# EAGLE design cathode_pcb (EAGLE 6.6.0)
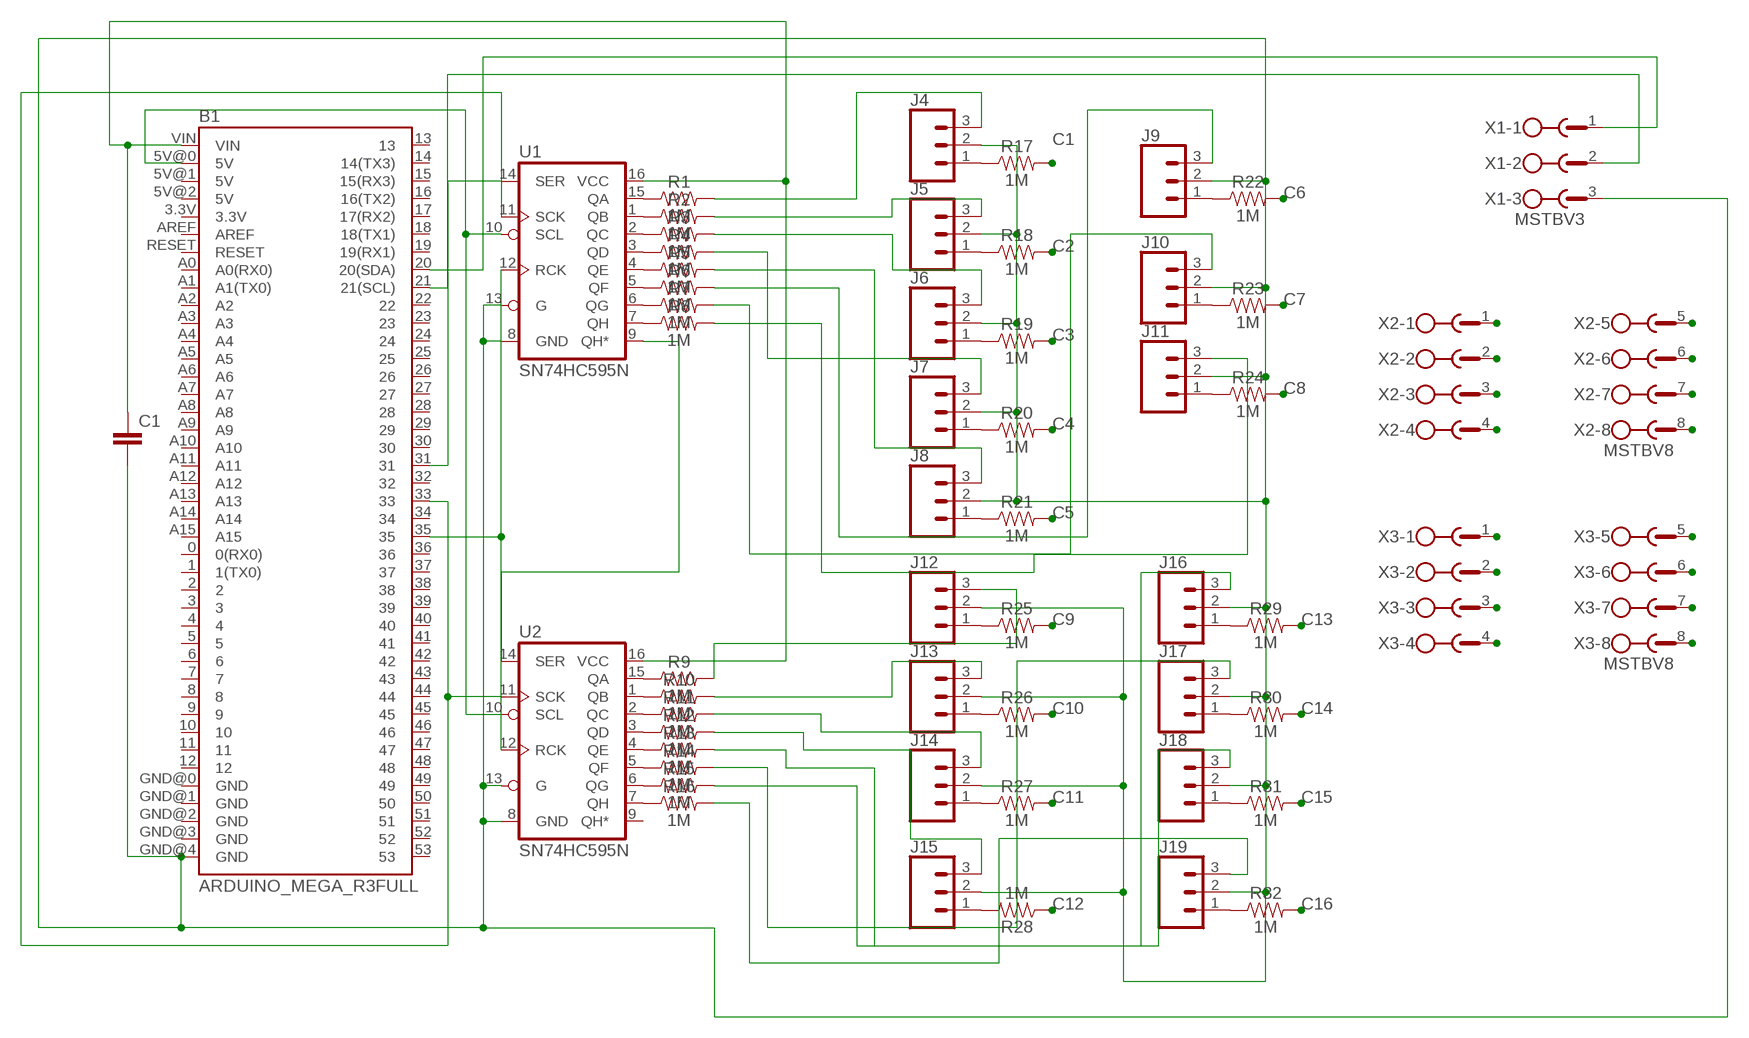
[diagram p0: schematic, sheet 1]

## Parts
B1  ARDUINO_MEGA_R3FULL  [ARDUINO_MEGA]
C1  C2.5/2  [C2.5-2]
J4  CONN_03  [1X03]
J5  CONN_03  [1X03]
J6  CONN_03  [1X03]
J7  CONN_03  [1X03]
J8  CONN_03  [1X03]
J9  CONN_03  [1X03]
J10  CONN_03  [1X03]
J11  CONN_03  [1X03]
J12  CONN_03  [1X03]
J13  CONN_03  [1X03]
J14  CONN_03  [1X03]
J15  CONN_03  [1X03]
J16  CONN_03  [1X03]
J17  CONN_03  [1X03]
J18  CONN_03  [1X03]
J19  CONN_03  [1X03]
R1  1M  1MOHM-HORIZ-1/4W-5%  [AXIAL-0.3]
R2  1M  1MOHM-HORIZ-1/4W-5%  [AXIAL-0.3]
R3  1M  1MOHM-HORIZ-1/4W-5%  [AXIAL-0.3]
R4  1M  1MOHM-HORIZ-1/4W-5%  [AXIAL-0.3]
R5  1M  1MOHM-HORIZ-1/4W-5%  [AXIAL-0.3]
R6  1M  1MOHM-HORIZ-1/4W-5%  [AXIAL-0.3]
R7  1M  1MOHM-HORIZ-1/4W-5%  [AXIAL-0.3]
R8  1M  1MOHM-HORIZ-1/4W-5%  [AXIAL-0.3]
R9  1M  1MOHM-HORIZ-1/4W-5%  [AXIAL-0.3]
R10  1M  1MOHM-HORIZ-1/4W-5%  [AXIAL-0.3]
R11  1M  1MOHM-HORIZ-1/4W-5%  [AXIAL-0.3]
R12  1M  1MOHM-HORIZ-1/4W-5%  [AXIAL-0.3]
R13  1M  1MOHM-HORIZ-1/4W-5%  [AXIAL-0.3]
R14  1M  1MOHM-HORIZ-1/4W-5%  [AXIAL-0.3]
R15  1M  1MOHM-HORIZ-1/4W-5%  [AXIAL-0.3]
R16  1M  1MOHM-HORIZ-1/4W-5%  [AXIAL-0.3]
R17  1M  1MOHM-HORIZ-1/4W-5%  [AXIAL-0.3]
R18  1M  1MOHM-HORIZ-1/4W-5%  [AXIAL-0.3]
R19  1M  1MOHM-HORIZ-1/4W-5%  [AXIAL-0.3]
R20  1M  1MOHM-HORIZ-1/4W-5%  [AXIAL-0.3]
R21  1M  1MOHM-HORIZ-1/4W-5%  [AXIAL-0.3]
R22  1M  1MOHM-HORIZ-1/4W-5%  [AXIAL-0.3]
R23  1M  1MOHM-HORIZ-1/4W-5%  [AXIAL-0.3]
R24  1M  1MOHM-HORIZ-1/4W-5%  [AXIAL-0.3]
R25  1M  1MOHM-HORIZ-1/4W-5%  [AXIAL-0.3]
R26  1M  1MOHM-HORIZ-1/4W-5%  [AXIAL-0.3]
R27  1M  1MOHM-HORIZ-1/4W-5%  [AXIAL-0.3]
R28  1M  1MOHM-HORIZ-1/4W-5%  [AXIAL-0.3]
R29  1M  1MOHM-HORIZ-1/4W-5%  [AXIAL-0.3]
R30  1M  1MOHM-HORIZ-1/4W-5%  [AXIAL-0.3]
R31  1M  1MOHM-HORIZ-1/4W-5%  [AXIAL-0.3]
R32  1M  1MOHM-HORIZ-1/4W-5%  [AXIAL-0.3]
U1  SN74HC595N  74HC595N  [DIP16]
U2  SN74HC595N  74HC595N  [DIP16]
X1  MSTBV3  [MSTBV3]
X2  MSTBV8  [MSTBV8]
X3  MSTBV8  [MSTBV8]

## Nets
C1: R17.P$2 X2.1
C2: R18.P$2 X2.2
C3: R19.P$2 X2.3
C4: R20.P$2 X2.4
C5: R21.P$2 X2.5
C6: R22.P$2 X2.6
C7: R23.P$2 X2.7
C8: R24.P$2 X2.8
C9: R25.P$2 X3.1
C10: R26.P$2 X3.2
C11: R27.P$2 X3.3
C12: R28.P$1 X3.4
C13: R29.P$2 X3.5
C14: R30.P$2 X3.6
C15: R31.P$2 X3.7
C16: R32.P$2 X3.8
N$1: J4.3 R1.P$2
N$2: J5.3 R2.P$2
N$3: R1.P$1 U1.15(QA)
N$4: R2.P$1 U1.1(QB)
N$5: R3.P$1 U1.2(QC)
N$6: R4.P$1 U1.3(QD)
N$7: R5.P$1 U1.4(QE)
N$8: R6.P$1 U1.5(QF)
N$9: R7.P$1 U1.6(QG)
N$10: R8.P$1 U1.7(QH)
N$11: R9.P$1 U2.15(QA)
N$12: R10.P$1 U2.1(QB)
N$13: R11.P$1 U2.2(QC)
N$14: R12.P$1 U2.3(QD)
N$15: R13.P$1 U2.4(QE)
N$16: R14.P$1 U2.5(QF)
N$17: R15.P$1 U2.6(QG)
N$18: R16.P$1 U2.7(QH)
N$19: J6.3 R3.P$2
N$20: J7.3 R4.P$2
N$21: J8.3 R5.P$2
N$22: J9.3 R6.P$2
N$23: J10.3 R7.P$2
N$24: J11.3 R8.P$2
N$25: J12.3 R9.P$2
N$26: J13.3 R10.P$2
N$27: J14.3 R11.P$2
N$28: J15.3 R12.P$2
N$29: J16.3 R13.P$2
N$30: U1.9(QH*) U2.14(SER)
N$31: J17.3 R14.P$2
N$32: J18.3 R15.P$2
N$33: J19.3 R16.P$2
N$34: B1.5V@0(5V) U1.10(SCL) U2.10(SCL)
N$35: B1.31 U1.14(SER)
N$36: B1.GND@4(GND) C1.2 J4.2 J5.2 J6.2 J7.2 J8.2 J9.2 J10.2 J11.2 J12.2 J13.2 J14.2 J15.2 J16.2 J17.2 J18.2 J19.2 U1.8(GND) U1.13(G) U2.8(GND) U2.13(G) X1.3
N$37: B1.35 U1.12(RCK) U2.12(RCK)
N$38: B1.33 U1.11(SCK) U2.11(SCK)
N$39: J19.1 R32.P$1
N$40: J18.1 R31.P$1
N$41: J17.1 R30.P$1
N$42: J16.1 R29.P$1
N$43: J15.1 R28.P$2
N$44: J14.1 R27.P$1
N$45: J13.1 R26.P$1
N$46: J12.1 R25.P$1
N$47: J11.1 R24.P$1
N$48: J10.1 R23.P$1
N$49: J9.1 R22.P$1
N$50: J4.1 R17.P$1
N$51: J5.1 R18.P$1
N$52: J6.1 R19.P$1
N$53: J7.1 R20.P$1
N$54: J8.1 R21.P$1
N$55: B1.20(20(SDA)) X1.1
N$56: B1.21(21(SCL)) X1.2
N$57: B1.VIN C1.1 U1.16(VCC) U2.16(VCC)
Unconnected: B1.0(0(RX0)) B1.1(1(TX0)) B1.2 B1.3 B1.3.3V B1.4 B1.5 B1.5V@1(5V) B1.5V@2(5V) B1.6 B1.7 B1.8 B1.9 B1.10 B1.11 B1.12 B1.13 B1.14(14(TX3)) B1.15(15(RX3)) B1.16(16(TX2)) B1.17(17(RX2)) B1.18(18(TX1)) B1.19(19(RX1)) B1.22 B1.23 B1.24 B1.25 B1.26 B1.27 B1.28 B1.29 B1.30 B1.32 B1.34 B1.36 B1.37 B1.38 B1.39 B1.40 B1.41 B1.42 B1.43 B1.44 B1.45 B1.46 B1.47 B1.48 B1.49 B1.50 B1.51 B1.52 B1.53 B1.A0(A0(RX0)) B1.A1(A1(TX0)) B1.A2 B1.A3 B1.A4 B1.A5 B1.A6 B1.A7 B1.A8 B1.A9 B1.A10 B1.A11 B1.A12 B1.A13 B1.A14 B1.A15 B1.AREF B1.GND@0(GND) B1.GND@1(GND) B1.GND@2(GND) B1.GND@3(GND) B1.RESET U2.9(QH*)

## Library data of the parts
B1 = SparkFun-Boards:ARDUINO_MEGA_R3: Arduino Mega R3 ATmega2560 R3 compatible footprint. SparkFun Products: Arduino Mega 2560 R3 <https://www.sparkfun.com/products/11061>
C1 = capacitor-wima:C: CAPACITOR naming: grid - package width
J4-J19 = SparkFun-Connectors:CONN_03: Multi connection point. Often used as Generic Header-pin footprint for 0.1 inch spaced/style header connections On any of the 0.1 inch spaced packages, you can populate with these: Break Away Headers - Straight <https://www.sparkfun.com/products/116> (PRT-00116) Break Away Male Headers - Right Angle <https://www.sparkfun.com/products/553> (PRT-00553) Female Headers <https://www.sparkfun.com/products/115> (PRT-00115) Break Away Headers - Machine Pin <https://www.sparkfun.com/products/117> (PRT-00117) Break Away Female Headers - Swiss Machine Pin <https://www.sparkfun.com/products/743> (PRT-00743) Stackable Header - 3 Pin (Female, 0.1") <https://www.sparkfun.com/products/13875> (PRT-13875) For SCREWTERMINALS and SPRING TERMINALS visit here: Screw Terimnals on SparkFun.com <https://www.sparkfun.com/search/results?term=Screw+Terminals> (5mm/3.5mm/2.54mm spacing) This device is also useful as a general connection point to wire up your design to another part of your project. Our various solder wires solder well into these plated through hole pads. Hook-Up Wire - Assortment (Stranded, 22 AWG) <https://www.sparkfun.com/products/11375> (PRT-11375) Hook-Up Wire - Assortment (Solid Core, 22 AWG) <https://www.sparkfun.com/products/11367> (PRT-11367) View the entire wire category on our website here <https://www.sparkfun.com/categories/141> Special notes: Molex polarized connector foot print use with SKU : PRT-08232 with associated crimp pins and housings.
R1-R32 = SparkFun-Resistors:1MOHM: 1MΩ resistor A resistor is a passive two-terminal electrical component that implements electrical resistance as a circuit element. Resistors act to reduce current flow, and, at the same time, act to lower voltage levels within circuits. - Wikipedia; PROD_ID: RES-09329
U1 U2 = SparkFun-IC-Logic:74*595: 8-Bit Shift Register (Serial to Parallel) Datasheet <http://cdn.sparkfun.com/datasheets/BreakoutBoards/MM74HC595.pdf> SparkFun Products SparkFun Shift Register Breakout - 74HC595 <https://www.sparkfun.com/products/10680> (BOB-10680); PROD_ID: IC-13123
X1 = con-phoenix-508:MSTBV3: PHOENIX; MPN: MSTBV 2,5/3-GF-5.08; OC_FARNELL: 1792793; OC_NEWARK: 69R9846
X2 X3 = con-phoenix-508:MSTBV8: PHOENIX; MPN: MSTBV 2,5/8-GF-5.08; OC_FARNELL: 1792797; OC_NEWARK: 69R9850

## Board
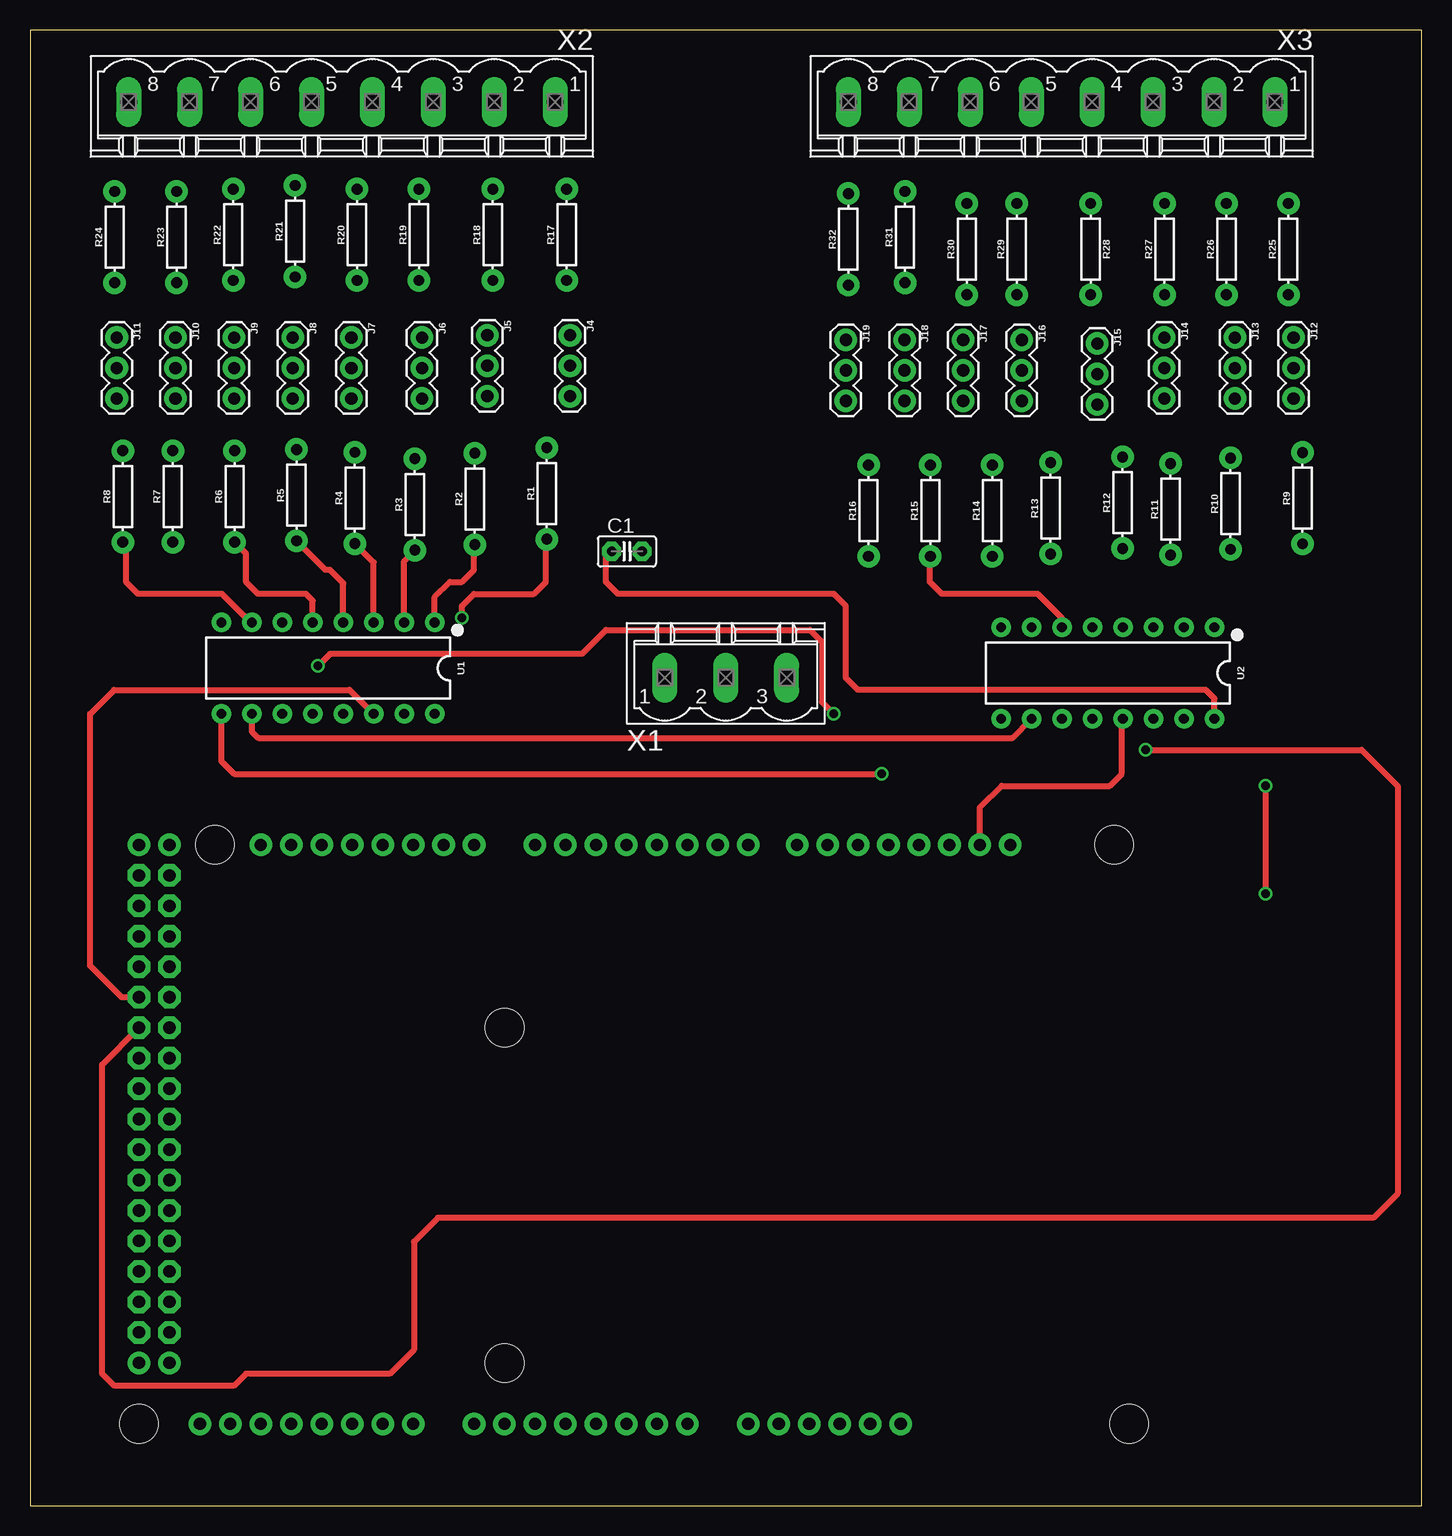
[diagram p1: board, top side]
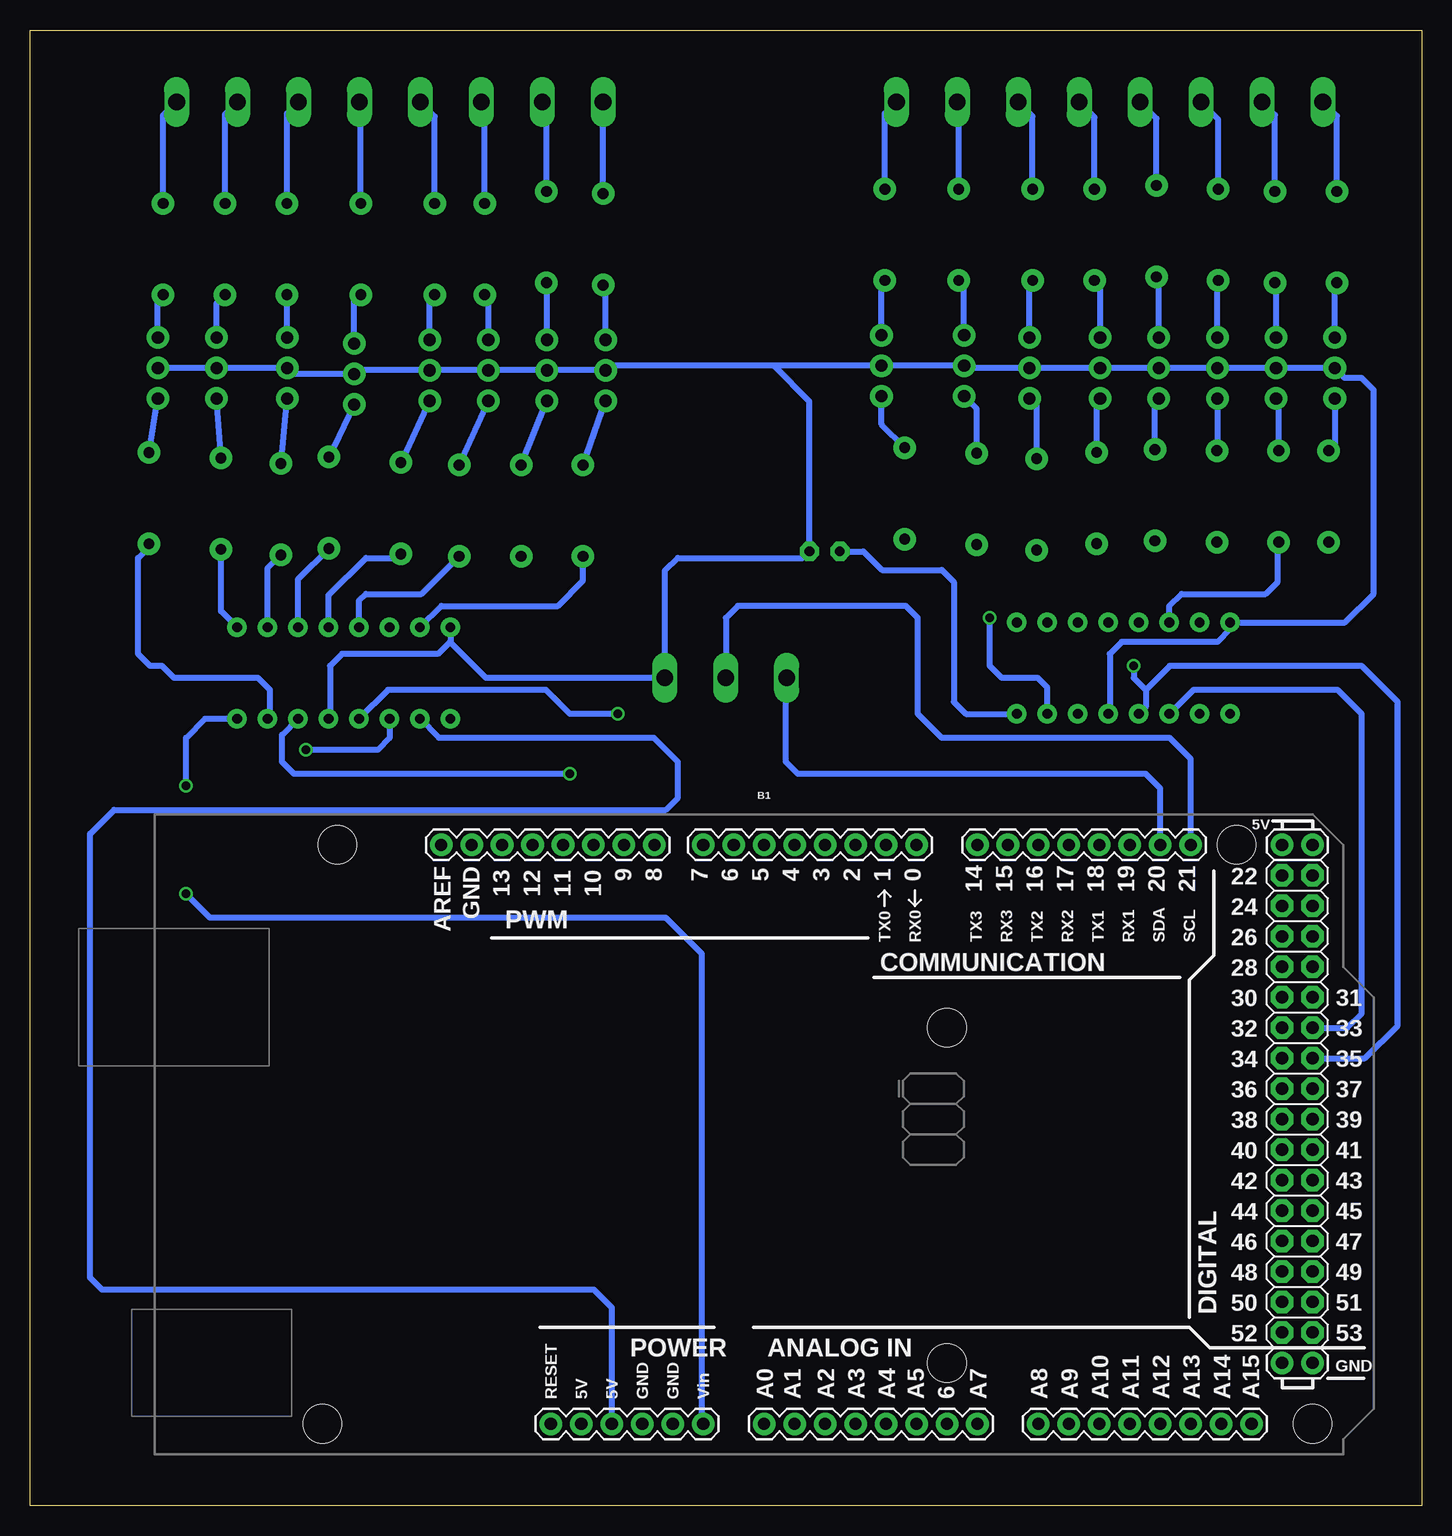
[diagram p2: board, bottom side, seen from below]

Size 116 x 123 mm. Coordinates in mm from the lower left corner, seen from the top.
Outline: 0,0 116,0 116,123 0,123 0,0
Copper layers (1*16): Top 0.035mm / dielectric 1.5mm / Bottom 0.035mm
Design rules "default": minimum track width 10mil, minimum drill 24mil, track to track 8mil, track to pad 8mil, pad to pad 8mil, via to via 8mil, smd to smd 8mil, copper to edge 40mil, drill to drill 8mil, minimum pad ring 10mil, minimum via ring 8mil, stop-mask expansion 4mil, vias tented up to drill 0mil, thermal gap 10mil

### Footprints (pad centres in the part's own frame; a part is rotated, then mirrored left to right if it is on the bottom)
ARDUINO_MEGA = drill 1.016 pad 1.88: 0 13.97,24.13; 1 11.43,24.13; 2 8.89,24.13; 3 6.35,24.13; 3.3V -13.97,-24.13; 4 3.81,24.13; 5 1.27,24.13; 5V@0 -11.43,-24.13; 5V@1 44.45,24.13; 5V@2 46.99,24.13; 6 -1.27,24.13; 7 -3.81,24.13; 8 -7.874,24.13; 9 -10.414,24.13; 10 -12.954,24.13; 11 -15.494,24.13; 12 -18.034,24.13; 13 -20.574,24.13; 14 19.05,24.13; 15 21.59,24.13; 16 24.13,24.13; 17 26.67,24.13; 18 29.21,24.13; 19 31.75,24.13; 20 34.29,24.13; 21 36.83,24.13; A0 1.27,-24.13; A1 3.81,-24.13; A2 6.35,-24.13; A3 8.89,-24.13; A4 11.43,-24.13; A5 13.97,-24.13; A6 16.51,-24.13; A7 19.05,-24.13; A8 24.13,-24.13; A9 26.67,-24.13; A10 29.21,-24.13; A11 31.75,-24.13; A12 34.29,-24.13; A13 36.83,-24.13; A14 39.37,-24.13; A15 41.91,-24.13; AREF -25.654,24.13; GND@0 -8.89,-24.13; GND@1 -6.35,-24.13; GND@2 44.45,-19.05; GND@3 46.99,-19.05; GND@4 -23.114,24.13; RESET -16.51,-24.13; VIN -3.81,-24.13 | drill 1.016 pad 1.88 octagon: 22 44.45,21.59; 23 46.99,21.59; 24 44.45,19.05; 25 46.99,19.05; 26 44.45,16.51; 27 46.99,16.51; 28 44.45,13.97; 29 46.99,13.97; 30 44.45,11.43; 31 46.99,11.43; 32 44.45,8.89; 33 46.99,8.89; 34 44.45,6.35; 35 46.99,6.35; 36 44.45,3.81; 37 46.99,3.81; 38 44.45,1.27; 39 46.99,1.27; 40 44.45,-1.27; 41 46.99,-1.27; 42 44.45,-3.81; 43 46.99,-3.81; 44 44.45,-6.35; 45 46.99,-6.35; 46 44.45,-8.89; 47 46.99,-8.89; 48 44.45,-11.43; 49 46.99,-11.43; 50 44.45,-13.97; 51 46.99,-13.97; 52 44.45,-16.51; 53 46.99,-16.51 | hole 3.2: -34.29,24.13; -35.56,-24.13; 16.51,8.89; 16.51,-19.05; 40.64,24.13; 46.99,-24.13
C2.5-2 = drill 0.813 pad 1.6 octagon: 1 -1.27,0; 2 1.27,0
1X03 = drill 1.016 pad 1.88: 1 0,0; 2 2.54,0; 3 5.08,0
AXIAL-0.3 = drill 0.9 pad 1.88: P$1 -3.81,0; P$2 3.81,0
DIP16 = drill 0.813 pad 1.626: 1 -8.89,-3.81; 2 -6.35,-3.81; 3 -3.81,-3.81; 4 -1.27,-3.81; 5 1.27,-3.81; 6 3.81,-3.81; 7 6.35,-3.81; 8 8.89,-3.81; 9 8.89,3.81; 10 6.35,3.81; 11 3.81,3.81; 12 1.27,3.81; 13 -1.27,3.81; 14 -3.81,3.81; 15 -6.35,3.81; 16 -8.89,3.81
MSTBV3 = drill 1.397 long: 1 -5.08,0; 2 0,0; 3 5.08,0
MSTBV8 = drill 1.397 long: 1 -17.78,0; 2 -12.7,0; 3 -7.62,0; 4 -2.54,0; 5 2.54,0; 6 7.62,0; 7 12.7,0; 8 17.78,0

### Placement (x,y rotation side)
B1  56.07,30.94 0 bottom
C1  49.76,79.54 0 top
J4  45.02,97.55 270 top
J5  38.13,97.55 270 top
J6  32.68,97.36 270 top
J7  26.79,97.36 270 top
J8  21.9,97.36 270 top
J9  17.01,97.36 270 top
J10  12.12,97.36 270 top
J11  7.23,97.36 270 top
J12  105.34,97.36 270 top
J13  100.45,97.36 270 top
J14  94.56,97.36 270 top
J15  88.97,96.86 270 top
J16  82.68,97.17 270 top
J17  77.79,97.17 270 top
J18  72.9,97.17 270 top
J19  68.01,97.17 270 top
R1  43.08,84.37 90 top
R2  37.08,83.91 90 top
R3  32.08,83.45 90 top
R4  27.08,83.99 90 top
R5  22.22,84.22 90 top
R6  17.06,84.12 90 top
R7  11.9,84.12 90 top
R8  7.74,84.12 90 top
R9  106.08,83.97 90 top
R10  100.08,83.51 90 top
R11  95.08,83.05 90 top
R12  91.08,83.59 90 top
R13  85.08,83.13 90 top
R14  80.22,82.93 90 top
R15  75.06,82.93 90 top
R16  69.9,82.93 90 top
R17  44.74,105.93 90 top
R18  38.58,105.93 90 top
R19  32.42,105.93 90 top
R20  27.26,105.93 90 top
R21  22.1,106.23 90 top
R22  16.94,105.93 90 top
R23  12.22,105.74 90 top
R24  7.06,105.74 90 top
R25  104.9,104.74 90 top
R26  99.74,104.74 90 top
R27  94.58,104.74 90 top
R28  88.42,104.74 270 top
R29  82.26,104.74 90 top
R30  78.1,104.74 90 top
R31  72.94,105.74 90 top
R32  68.22,105.55 90 top
U1  24.84,69.8 180 top
U2  89.84,69.4 180 top
X1  58,69 0 top
X2  26,117 180 top
X3  86,117 180 top

### Tracks (layer width: path | path; a pad name or v marks a point on that pad's centre or on a via)
C1
  Bottom 0.5: R17.P$2 44.74,116.04 X2.1
C2
  Bottom 0.5: R18.P$2 38.58,116.88 X2.2
C3
  Bottom 0.5: R19.P$2 32.42,115.8 X2.3
C4
  Bottom 0.5: R20.P$2 27.26,115.72 X2.4
C5
  Bottom 0.5: R21.P$2 22.1,115.64 X2.5
C6
  Bottom 0.5: R22.P$2 16.94,115.56 X2.6
C7
  Bottom 0.5: R23.P$2 12.22,115.92 X2.7
C8
  Bottom 0.5: R24.P$2 7.06,115.84 X2.8
C9
  Bottom 0.5: R25.P$2 104.9,115.88 X3.1
C10
  Bottom 0.5: R26.P$2 99.74,115.96 X3.2
C11
  Bottom 0.5: R27.P$2 94.58,116.04 X3.3
C12
  Bottom 0.5: R28.P$1 88.42,116.88 X3.4
C13
  Bottom 0.5: R29.P$2 82.26,115.8 X3.5
C14
  Bottom 0.5: R30.P$2 78.1,116.72 X3.6
C15
  Bottom 0.5: R31.P$2 72.94,116.64 X3.7
C16
  Bottom 0.5: R32.P$2 X3.8
N$1
  Bottom 0.5: R1.P$2 45.02,90.12 J4.3
N$2
  Bottom 0.5: R2.P$2 37.08,91.42 J5.3
N$3  (via drill 0.7)
  Top 0.5: v36,74 36,75 37,76 42,76 43,77 43,80.48 R1.P$1
  Bottom 0.5: U1.15 31.19,68.19 32,69 35,69 36,70 v36,74
N$4
  Top 0.5: U1.1 33.73,75.73 35,77 36,77 37,78 37,80.02 R2.P$1
N$5
  Top 0.5: U1.2 31.19,78.75 R3.P$1
N$6
  Top 0.5: U1.3 28.65,78.61 R4.P$1
N$7
  Top 0.5: U1.4 26.11,76.89 25,78 24.63,78 R5.P$1
N$8
  Top 0.5: U1.5 23.57,75.43 23,76 19,76 18,77 18,79.37 R6.P$1
N$9
  Bottom 0.5: U1.6 21.03,74.97 20,76 13,76 12,77 12,80.21 R7.P$1
N$10
  Top 0.5: U1.7 18.39,73.61 16,76 9,76 8,77 8,80.05 R8.P$1
N$11
  Bottom 0.5: U2.15 96,65.78 96,68 97,69 104,69 105,70 106,70 107,71 107,79 106.08,79.92 R9.P$1
N$12
  Bottom 0.5: U2.1 100.08,74.56 R10.P$1
N$13
  Bottom 0.5: U2.2 96.19,78.13 R11.P$1
N$14
  Bottom 0.5: U2.3 93.65,77.21 R12.P$1
N$15
  Bottom 0.5: U2.4 91.11,75.89 88,79 85.4,79 R13.P$1
N$16
  Bottom 0.5: U2.5 88.57,75.43 88,76 83.34,76 R14.P$1
N$17
  Top 0.5: U2.6 86.03,73.97 84,76 76,76 75,77 75,79.06 R15.P$1
N$18
  Bottom 0.5: U2.7 81.7,75 72,75 69.9,77.1 R16.P$1
N$19
  Bottom 0.5: R3.P$2 32.08,91.68 J6.3
N$20
  Bottom 0.5: R4.P$2 27.08,91.99 J7.3
N$21
  Bottom 0.5: R5.P$2 22.22,91.96 J8.3
N$22
  Bottom 0.5: J9.3 17.01,87.98 R6.P$2
N$23
  Bottom 0.5: R7.P$2 11.9,92.06 J10.3
N$24
  Bottom 0.5: J11.3 7.23,88.44 R8.P$2
N$25
  Bottom 0.5: R9.P$2 J12.3
N$26
  Bottom 0.5: R10.P$2 J13.3
N$27
  Bottom 0.5: R11.P$2 J14.3
N$28
  Bottom 0.5: R12.P$2 J15.3
N$29
  Bottom 0.5: R13.P$2 J16.3
N$30  (via drill 0.7)
  Top 0.5: U1.9 15.95,62.05 17,61 v71,61
  Bottom 0.5: v71,61 94,61 95,62 95,64.24 U2.14
N$31
  Bottom 0.5: R14.P$2 J17.3
N$32
  Bottom 0.5: R15.P$2 J18.3
N$33
  Bottom 0.5: R16.P$2 J19.3
N$34
  Top 0.5: U1.10 18.49,64.51 19,64 81.9,64 U2.10
  Bottom 0.5: B1.5V@0 67.5,16.5 69,18 110,18 111,19 111,56 109,58 63,58 62,59 62,62 64,64 81.9,64 U2.10
N$35
  Top 0.5: B1.31 7.63,42.37 5,45 5,66 7,68 26.64,68 U1.14
N$36
  Top 0.5: B1.GND@4 79.18,58.18 81,60 90,60 91,61 91,65.48 U2.13
  Bottom 0.5: U2.8 80.95,72.05 81,72 | 81,72 82,71 90,71 91,70 91,65.7 U2.13 | 81,72 78,69 X1.3 63.08,77.92 62,79 51.57,79 C1.2 51.03,92.04 54,95.01 | U1.13 26,66.1 26,71 25,72 17,72 15.95,73.05 U1.8 6.39,73.61 4,76 4,93 5,94 6.41,94 J11.2 J10.2 J9.2 J8.2 J7.2 J6.2 37.94,94.82 J5.2 J4.2 54,95.01 | 54,95.01 67.63,95.01 J19.2 J18.2 J17.2 78,94.63 J16.2 88.66,94.63 J15.2 94.06,94.32 J14.2 J13.2 J12.2
N$37  (via drill 0.7)
  Top 0.5: v67,66 66,67 66,72 65,73 48,73 46,71 25,71 v24,70
  Bottom 0.5: B1.35 4.71,37.29 2,40 2,67 5,70 21,70 23,68 | 23,68 23,66.56 U1.12 | v67,66 71,66 73,68 86.16,68 U2.12 | v24,70 24,69 23,68
N$38  (via drill 0.7)
  Top 0.5: v93,63 111,63 114,60 114,26 112,24 34,24 32,22 32,13 30,11 18,11 17,10 7,10 6,11 6,36.75 B1.33
  Bottom 0.5: B1.33 6.17,39.83 5,41 5,66 7,68 19.02,68 U1.11 | U2.11 86.03,63.97 87,63 v93,63
N$39
  Bottom 0.5: J19.1 68.01,101.53 R32.P$1
N$40
  Bottom 0.5: J18.1 72.9,101.89 R31.P$1
N$41
  Bottom 0.5: J17.1 77.79,100.62 R30.P$1
N$42
  Bottom 0.5: J16.1 82.68,100.51 R29.P$1
N$43
  Bottom 0.5: J15.1 88.97,100.38 R28.P$2
N$44
  Bottom 0.5: J14.1 94.56,100.91 R27.P$1
N$45
  Bottom 0.5: J13.1 100.45,100.22 R26.P$1
N$46
  Bottom 0.5: J12.1 105.34,100.49 R25.P$1
N$47
  Bottom 0.5: J11.1 7.23,101.76 R24.P$1
N$48
  Bottom 0.5: J10.1 12.12,101.83 R23.P$1
N$49
  Bottom 0.5: J9.1 17.01,102.05 R22.P$1
N$50
  Bottom 0.5: J4.1 45.02,101.84 R17.P$1
N$51
  Bottom 0.5: J5.1 38.13,101.67 R18.P$1
N$52
  Bottom 0.5: J6.1 32.68,101.86 R19.P$1
N$53
  Bottom 0.5: J7.1 26.79,101.65 R20.P$1
N$54
  Bottom 0.5: J8.1 21.9,102.22 R21.P$1
N$55
  Bottom 0.5: B1.20 21.78,59.78 23,61 52,61 53,62 53,68.92 X1.1
N$56
  Bottom 0.5: B1.21 19.24,62.24 21,64 40,64 42,66 42,74 43,75 57,75 58,74 X1.2
N$57  (via drill 0.7)
  Top 0.5: U2.16 98.73,67.27 98,68 69,68 68,69 68,75 67,76 49,76 48,77 48,79.05 C1.1 | v103,51 v103,60
  Bottom 0.5: C1.1 46.54,79.54 45,78 40,78 39,77 39,67 38,66 U1.16 | B1.VIN 60,6.93 60,46 63,49 101,49 v103,51 | v103,60 103,64 101.41,65.59 U2.16